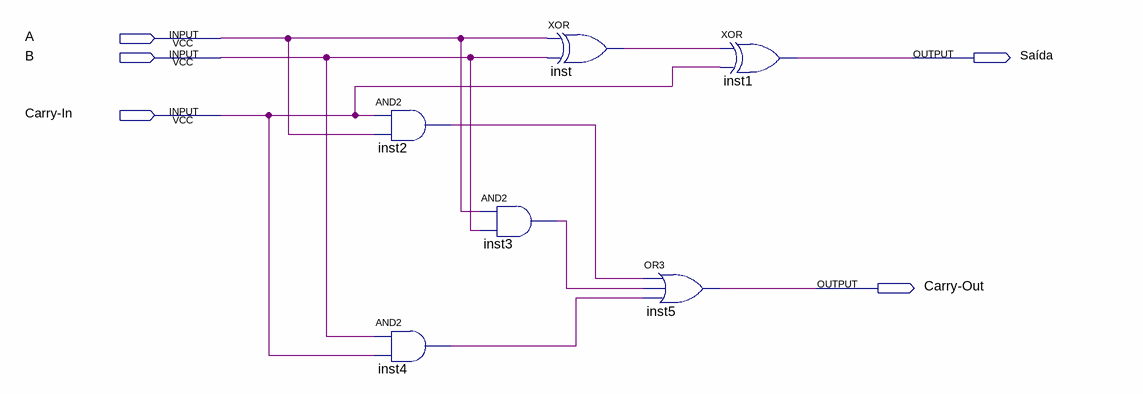
[diagram p0: schematic sheet]
// Quartus schematic FullAdder.bdf as structural Verilog: 6 symbols, 5 pins
module FullAdder (
  input  A,
  input  B,
  input  \Carry-In ,
  output \Saída ,
  output \Carry-Out 
);

  wire inst2_out, inst3_out, inst4_out, inst_out;

  and inst2 (inst2_out, \Carry-In , A);
  and inst4 (inst4_out, B, \Carry-In );
  and inst3 (inst3_out, A, B);
  xor inst (inst_out, A, B);
  or inst5 (\Carry-Out , inst2_out, inst3_out, inst4_out);
  xor inst1 (\Saída , inst_out, \Carry-In );
endmodule
